# EasyEDA Pro project ProPrj_51单片机核心板_2025-12-06.epro

# Schematic 51单片机核心板原理图
Board Name: 51单片机核心板; Create Date: 2025-12-05; Page Name: P1; Project Name: 51单片机核心板; Schematic Name: 51单片机核心板原理图; Update Date: 2025-12-05; Company: 嘉立创EDA; Page Size: A4; Version: V1.0
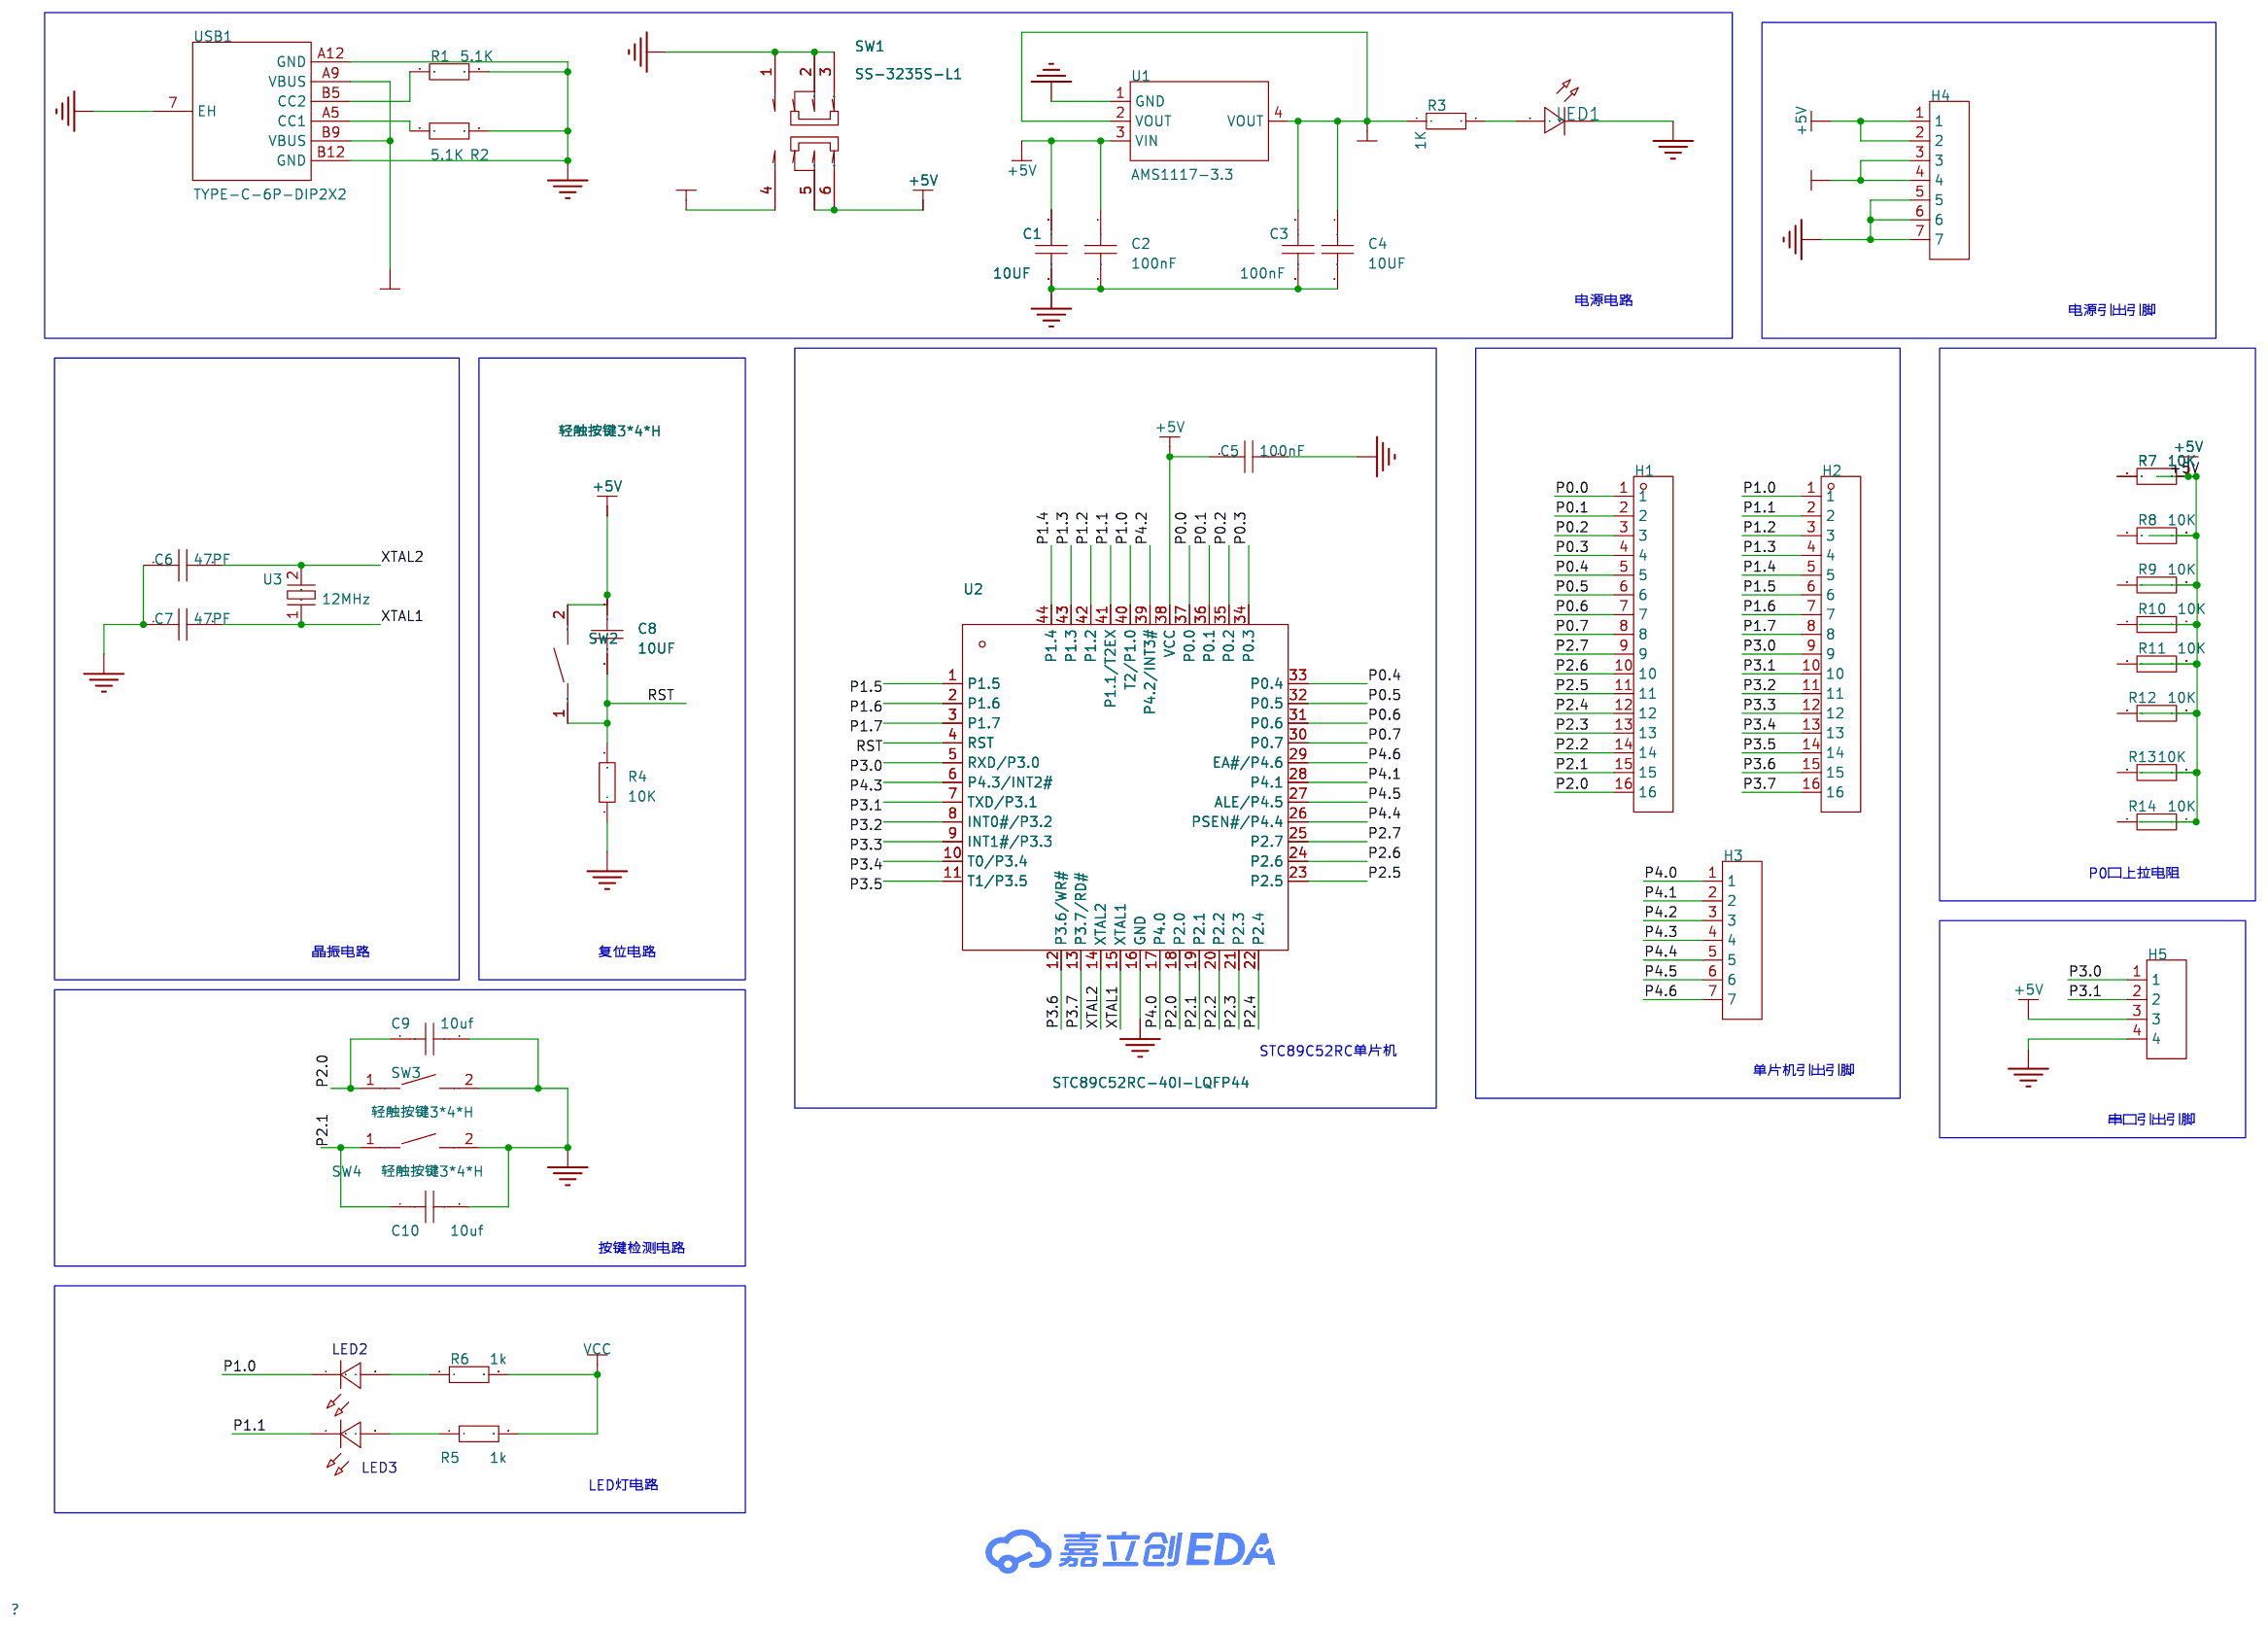
[diagram p0: schematic sheet]

## Parts
C1  10UF  [C0805]
C2  100nF  [C0805]
C3  100nF  [C0805]
C4  10UF  [C0805]
C5  100nF  [C0805]
C6  47PF  [C0603]
C7  47PF  [C0603]
C8  10UF  [C0603]
C9  10uf  [C0603]
C10  10uf  [C0603]
H1  -  [HDR-TH_16P-P2.54-V-M]
H2  -  [HDR-TH_16P-P2.54-V-M]
H3  -  [HDR-TH_7P-P2.54-V-M]
H4  -  [HDR-TH_7P-P2.54-V-M]
H5  -  [HDR-TH_4P-P2.54-V-M]
LED1  -  [LED_0805]
LED2  -  [LED_0805]
LED3  -  [LED_0805]
R1  5.1K  [R0805]
R2  5.1K  [R0805]
R3  1K  [R0805]
R4  10K  [R0603]
R5  1k  [R0603]
R6  1k  [R0603]
R7  10K  [R0603]
R8  10K  [R0603]
R9  10K  [R0603]
R10  10K  [R0603]
R11  10K  [R0603]
R12  10K  [R0603]
R13  10K  [R0603]
R14  10K  [R0603]
SW1  SS-3235S-L1  [SW-SMD_SS-3235S-LX]
SW2  轻触按键3*4*H  [SW-SMD_L4.0-W2.9-LS5.0]
SW3  轻触按键3*4*H  [SW-SMD_L4.0-W2.9-LS5.0]
SW4  轻触按键3*4*H  [SW-SMD_L4.0-W2.9-LS5.0]
U1  AMS1117-3.3  [SOT-223-3_L6.5-W3.4-P2.30-LS7.0-BR]
U2  STC89C52RC-40I-LQFP44  [LQFP-44_L10.0-W10.0-P0.80-LS12.0-BL]
U3  12MHz  [CRYSTAL-SMD_L11.4-W4.7-LS12.7]
USB1  TYPE-C-6P-DIP2X2  [TYPE-C-SMD_TYPE-C-6P]

## Library data of the parts
C1-C5 = CAP_0805: Supplier Footprint: 0805
C6-C10 = CAP_0603: Supplier Footprint: 0603
H1 H2 = HDR-M_2.54_1x16P: 间距:2.54mm;总PIN位数:16;排数:1;插针结构:1x16P;行距:-;安装类型:直插;圆针/方针:方针;额定电流:3A;额定电压:-;配合针长度:6mm;塑高:2.5mm;端接针长度:3mm;触头材质:-;工作温度范围:-40℃~+105℃;颜色:黑色;; Supplier Part: C2894939; Supplier Footprint: 插件
H3 H4 = HDR-M_2.54_1x7P: Supplier Part: C492406; Supplier Footprint: 插件
H5 = HDR-M_2.54_1x4P: Supplier Part: C492403; Supplier Footprint: 插件
LED1 = LED_0805-R: Supplier Footprint: 0805
LED2 LED3 = LED_0805-G: Supplier Footprint: 0805
R1-R3 = Res_0805: Supplier Footprint: 0805
R4-R14 = Res_0603: Supplier Footprint: 0603
SW1 = SS-3235S-L1: 电路结构:双刀双掷;安装方式:卧贴;开关颜色:黑色;额定电流:50mA;额定电压:12V;工作寿命:1万次;; LCSC Part Name: 柄长2mm 卧贴双档 滑动开关; Supplier Part: C500055; Manufacturer: XKB Connection(中国星坤); Supplier Footprint: SMD,9.1x3.6mm; JLCPCB Part Class: 扩展库; Datasheet: https://item.szlcsc.com/datasheet/SS-3235S-L1/512181.html; Supplier: LCSC; Circuit: 双刀双掷; Actuator Style: 矩形柱状; Termination Style: 鸥翼型; Length: 9.1mm; Width: 3.55mm; Switch Height: 3.2mm; Mounting Type: 卧贴; Actuator Color: 黑色; Current Rating: 50mA; Voltage Rating: 12V; Life: 1万次; Operating Temperature: -40℃~+85℃
SW2-SW4 = 轻触按键3*4*H: Supplier Part: C9900017573; Supplier Footprint: 轻触按键3*4*2.5; JLCPCB Part Class: 扩展库; Supplier: LCSC
U1 = AMS1117-3.3_C6186: 输出类型:固定;工作电压:16V;输出电压:3.3V;输出电流:1A;电源纹波抑制比(PSRR):72dB@(120Hz);输出极性:正极;; LCSC Part Name: 输出3.3V 1A; Supplier Part: C6186; Manufacturer: AMS; Supplier Footprint: SOT-223; JLCPCB Part Class: 基础库; Datasheet: https://item.szlcsc.com/datasheet/AMS1117-3.3/6652.html; Supplier: LCSC; Output Type: 固定; Voltage - Supply: 16V; Output Voltage: 3.3V; Output Current: 1A; Power Supply Rejection Ratio (PSRR): 72dB@(120Hz); Voltage Dropout: 1.1V@(800mA); standby current: 5mA; Noise: 0.003%Vout; Features: 过流保护；过热保护; Operating Temperature: -40℃~+125℃; Output Configuration: 正极; Number of Outputs: 1
U2 = STC89C52RC-40I-LQFP44: CPU内核:51系列;应用领域:-;; Supplier Part: C8707; Manufacturer: STC; Supplier Footprint: LQFP-44(10x10); JLCPCB Part Class: 扩展库; Datasheet: https://item.szlcsc.com/datasheet/STC89C52RC-40I-LQFP44/9213.html; Supplier: LCSC; CPU Core: 51系列; Program Storage Size: 8KB; Program Memory Type: FLASH; Number of I/O: 39; Voltage - Supply: 3.3V~5.5V
U3 = ABLS-12.000MHZ-B4H-T: 频率:12MHz;常温频差:±30ppm;负载电容:18pF;频率稳定度:±35ppm;; LCSC Part Name: 12MHz ±30ppm 18pF; Supplier Part: C1986452; Manufacturer: ABRACON; Supplier Footprint: HC-49S-SMD; JLCPCB Part Class: 扩展库; Datasheet: https://item.szlcsc.com/datasheet/ABLS-12.000MHZ-B4H-T/2077997.html; Supplier: LCSC; Normal temperature Frequency Tolerance: ±30ppm; Load Capacitance: 18pF; Frequency Stability: ±35ppm; Equivalent Series Resistance(ESR): 50Ω; Operating Temperature: -20℃~+70℃
USB1 = TYPE-C-6P-DIP2X2: Supplier Part: C9900017627; Supplier Footprint: TYPE-C-6P; JLCPCB Part Class: 扩展库; Supplier: LCSC

## Nets
3.3V: C3.1 C4.1 H4.3 H4.4 R3.1 U1.2(VOUT) U1.4(VOUT)
+5V: C1.1 C2.1 C5.2 C8.2 H4.1 H4.2 H5.3 R7.2 R8.2 R9.2 R10.2 R11.2 R12.2 R13.2 R14.2 SW1.5 SW1.6 SW2.2 U1.3(VIN) U2.38(VCC)
GND: C1.2 C2.2 C3.2 C4.2 C5.1 C6.1 C7.1 C9.2 C10.2 H4.5 H4.6 H4.7 H5.4 LED1.1(C) R1.2 R2.2 R4.1 SW1.1 SW1.2 SW1.3 SW3.2 SW4.2 U1.1(GND) U2.16(GND) USB1.7(EH) USB1.A12(GND) USB1.B12(GND)
VCC: R5.2 R6.2
VCC+5V: SW1.4 USB1.A9(VBUS) USB1.B9(VBUS)
P0.0: H1.1 U2.37(P0.0)
P0.1: H1.2 U2.36(P0.1)
P0.2: H1.3 U2.35(P0.2)
P0.3: H1.4 U2.34(P0.3)
P0.4: H1.5 U2.33(P0.4)
P0.5: H1.6 U2.32(P0.5)
P0.6: H1.7 U2.31(P0.6)
P0.7: H1.8 U2.30(P0.7)
P1.0: H2.1 LED2.1(C) U2.40(T2/P1.0)
P1.1: H2.2 LED3.1(C) U2.41(P1.1/T2EX)
P1.2: H2.3 U2.42(P1.2)
P1.3: H2.4 U2.43(P1.3)
P1.4: H2.5 U2.44(P1.4)
P1.5: H2.6 U2.1(P1.5)
P1.6: H2.7 U2.2(P1.6)
P1.7: H2.8 U2.3(P1.7)
P2.0: C9.1 H1.16 SW3.1 U2.18(P2.0)
P2.1: C10.1 H1.15 SW4.1 U2.19(P2.1)
P2.2: H1.14 U2.20(P2.2)
P2.3: H1.13 U2.21(P2.3)
P2.4: H1.12 U2.22(P2.4)
P2.5: H1.11 U2.23(P2.5)
P2.6: H1.10 U2.24(P2.6)
P2.7: H1.9 U2.25(P2.7)
P3.0: H2.9 H5.1 U2.5(RXD/P3.0)
P3.1: H2.10 H5.2 U2.7(TXD/P3.1)
P3.2: H2.11 U2.8(INT0#/P3.2)
P3.3: H2.12 U2.9(INT1#/P3.3)
P3.4: H2.13 U2.10(T0/P3.4)
P3.5: H2.14 U2.11(T1/P3.5)
P3.6: H2.15 U2.12(P3.6/WR#)
P3.7: H2.16 U2.13(P3.7/RD#)
P4.0: H3.1 U2.17(P4.0)
P4.1: H3.2 U2.28(P4.1)
P4.2: H3.3 U2.39(P4.2/INT3#)
P4.3: H3.4 U2.6(P4.3/INT2#)
P4.4: H3.5 U2.26(PSEN#/P4.4)
P4.5: H3.6 U2.27(ALE/P4.5)
P4.6: H3.7 U2.29(EA#/P4.6)
RST: C8.1 R4.2 SW2.1 U2.4(RST)
XTAL1: C7.2 U2.15(XTAL1) U3.1
XTAL2: C6.2 U2.14(XTAL2) U3.2(GND)
$1N276: R1.1 USB1.B5(CC2)
$1N281: R2.1 USB1.A5(CC1)
$1N990: LED1.2(A) R3.2
$1N3495: LED2.2(A) R6.1
$1N3509: LED3.2(A) R5.1

Not connected (* = marked no-connect by the designer): R7 1; R8 1; R9 1; R10 1; R11 1; R12 1; R13 1; R14 1

## Notes on the sheet
- 电源电路
- 电源引出引脚
- P0口上拉电阻
- 晶振电路
- 复位电路
- STC89C52RC单片机
- 单片机引出引脚
- 串口引出引脚
- 按键检测电路
- LED灯电路

# Board 51单片机核心板pcb
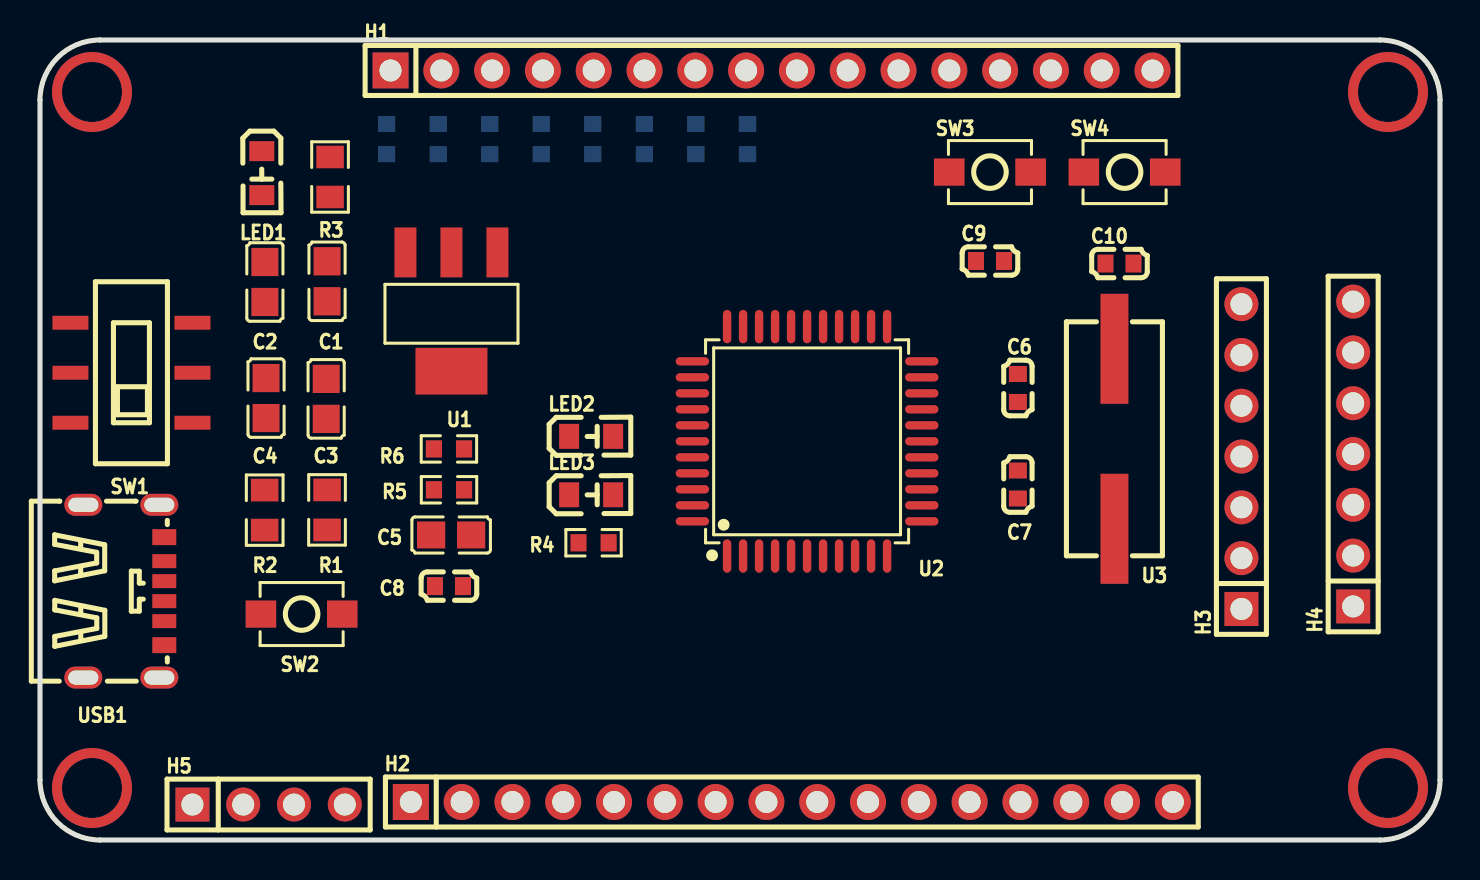
[diagram p1: board, top side]
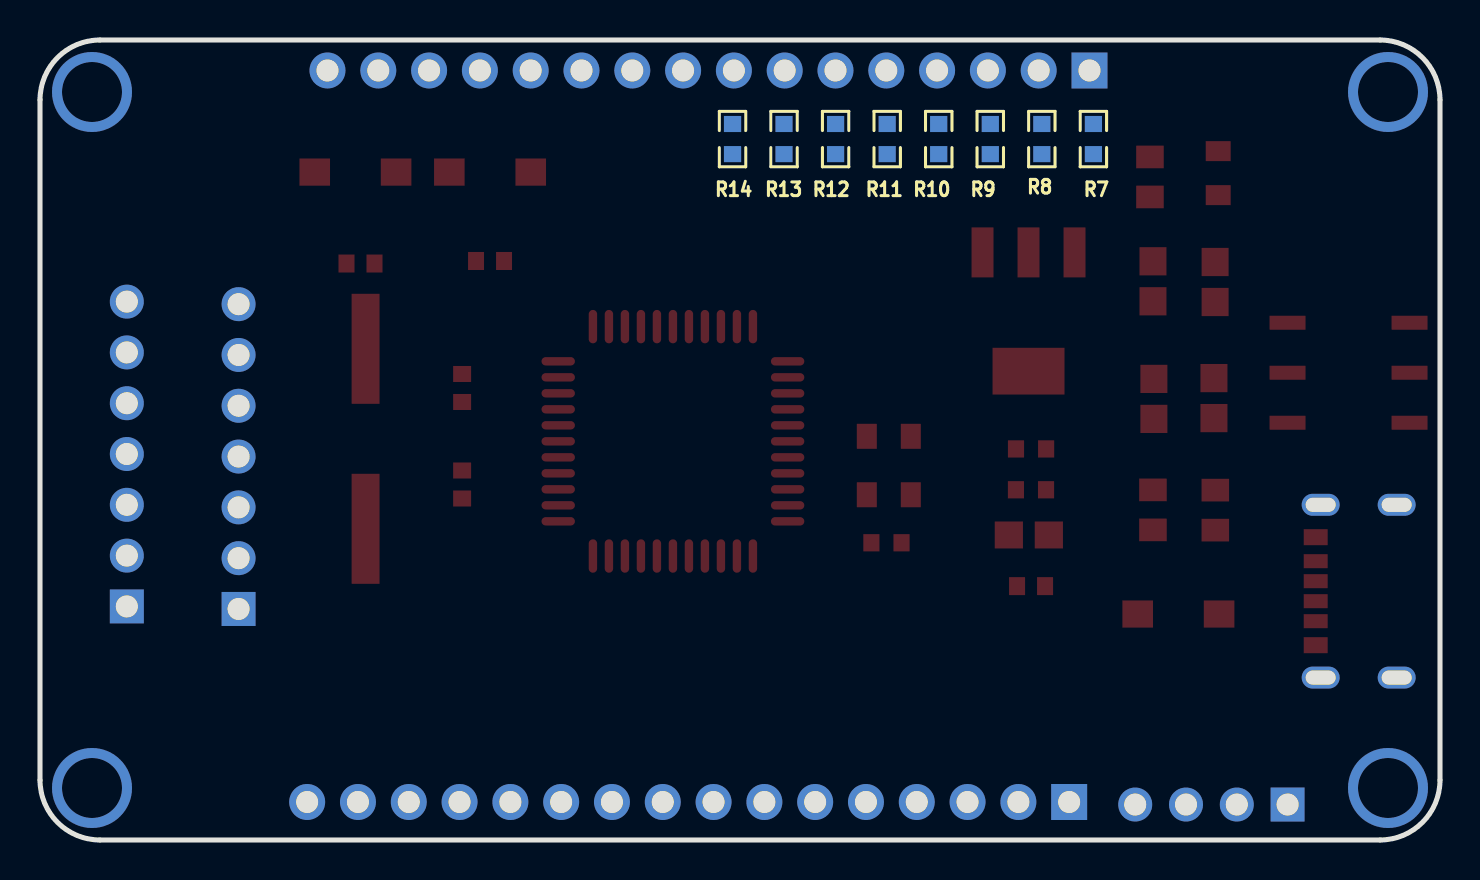
[diagram p2: board, bottom side, seen from below]

Outline 70 x 40 mm; copper layers: Top Layer, Bottom Layer. Coordinates in mm from the lower left corner of the outline.
Outline path: 0,37 0,3 arc(0.88,0.88) 3,0 67,0 arc(69.12,0.88) 70,3 70,37 arc(69.12,39.12) 67,40 3,40 arc(0.88,39.12) 0,37
Stack: Top Layer 0.035mm / Dielectric1 1.51mm FR4 er 4.5 / Bottom Layer 0.035mm

## Design rules (mm)
template: JLCPCB Capability(Two Layers Board)
spacing copperThickness1oz (default): track to track 0.102, other pairs 0.152 to 0.3
spacing copperThickness2oz: track to track 0.203, other pairs 0.152 to 0.3
track width copperThickness1oz (default): min 0.127, default 0.254, max 2.54
track width copperThickness2oz: min 0.203, default 0.254, max 2.54
differential pair differentialPair (default): width min 0.127, default 0.254, max 2.54; gap min 0.152, default 0.152
via viaSize (default): diameter min 0.5, default 0.61, max 10; hole min 0.3, default 0.305, max 6.3

## Placement (name value [footprint] x y rotation side)
C1  10UF  [C0805]  14.35 27.94 270 top
C2  100nF  [C0805]  11.24 27.9 270 top
C3  100nF  [C0805]  14.31 22.06 90 top
C4  10UF  [C0805]  11.3 22.1 90 top
C5  100nF  [C0805]  20.56 15.25 0 top
C6  47PF  [C0603]  48.9 22.6 90 top
C7  47PF  [C0603]  48.9 17.78 90 top
C8  10UF  [C0603]  20.45 12.69 180 top
C9  10uf  [C0603]  47.5 28.95 0 top
C10  10uf  [C0603]  53.97 28.82 0 top
H1  -  [HDR-TH_16P-P2.54-V-M]  36.58 38.48 0 top
H2  -  [HDR-TH_16P-P2.54-V-M]  37.59 1.9 0 top
H3  -  [HDR-TH_7P-P2.54-V-M]  60.07 19.17 90 top
H4  -  [HDR-TH_7P-P2.54-V-M]  65.66 19.3 90 top
H5  -  [HDR-TH_4P-P2.54-V-M]  11.43 1.77 0 top
LED1  -  [LED_0805]  11.09 33.29 270 top
LED2  -  [LED_0805]  27.61 20.18 0 top
LED3  -  [LED_0805]  27.61 17.26 0 top
R1  5.1K  [R0805]  14.35 16.5 90 top
R2  5.1K  [R0805]  11.23 16.49 270 top
R3  1K  [R0805]  14.5 33.15 90 top
R4  10K  [R0603]  27.68 14.86 0 top
R5  1k  [R0603]  20.45 17.51 0 top
R6  1k  [R0603]  20.45 19.55 0 top
R7  10K  [R0603]  17.33 35.05 90 bottom
R8  10K  [R0603]  19.91 35.05 90 bottom
R9  10K  [R0603]  22.49 35.05 90 bottom
R10  10K  [R0603]  25.06 35.05 90 bottom
R11  10K  [R0603]  27.64 35.05 90 bottom
R12  10K  [R0603]  30.22 35.05 90 bottom
R13  10K  [R0603]  32.8 35.05 90 bottom
R14  10K  [R0603]  35.37 35.05 90 bottom
SW1  SS-3235S-L1  [SW-SMD_SS-3235S-LX]  4.57 23.36 270 top
SW2  轻触按键3*4*H  [SW-SMD_L4.0-W2.9-LS5.0]  13.08 11.3 0 top
SW3  轻触按键3*4*H  [SW-SMD_L4.0-W2.9-LS5.0]  47.5 33.4 0 top
SW4  轻触按键3*4*H  [SW-SMD_L4.0-W2.9-LS5.0]  54.23 33.4 0 top
U1  AMS1117-3.3  [SOT-223-3_L6.5-W3.4-P2.30-LS7.0-BR]  20.57 26.41 90 top
U2  STC89C52RC-40I-LQFP44  [LQFP-44_L10.0-W10.0-P0.80-LS12.0-BL]  38.35 19.93 0 top
U3  12MHz  [CRYSTAL-SMD_L11.4-W4.7-LS12.7]  53.72 20.06 90 top
USB1  TYPE-C-6P-DIP2X2  [TYPE-C-SMD_TYPE-C-6P]  4.19 12.44 270 top

## Footprints (pads in the part's own frame, mm; a bottom-side part is the same pattern mirrored in y, then rotated)
C0603
  rect 0.8x0.9 smd: 1(-0.7,0) 2(0.7,0)
C0805
  rect 1.41x1.35 smd: 1(-1,0) 2(1,0)
CRYSTAL-SMD_L11.4-W4.7-LS12.7
  rect 5.5x1.4 smd: 1(-4.5,0) 2(4.5,0)
HDR-TH_4P-P2.54-V-M
  rect 1.7x1.7 hole 1.1: 1(-3.81,0)
  round 1.7 hole 1.1: 2(-1.27,0) 3(1.27,0) 4(3.81,0)
HDR-TH_7P-P2.54-V-M
  rect 1.7x1.7 hole 1.1: 1(-7.62,0)
  round 1.7 hole 1.1: 2(-5.08,0) 3(-2.54,0) 4(0,0) 5(2.54,0) 6(5.08,0) 7(7.62,0)
HDR-TH_16P-P2.54-V-M
  rect 1.8x1.8 hole 1.1: 1(-19.05,0)
  round 1.8 hole 1.1: 2(-16.51,0) 3(-13.97,0) 4(-11.43,0) 5(-8.89,0) 6(-6.35,0) 7(-3.81,0) 8(-1.27,0) 9(1.27,0) 10(3.81,0) 11(6.35,0) 12(8.89,0) 13(11.43,0) 14(13.97,0) 15(16.51,0) 16(19.05,0)
LED_0805
  rect 1x1.25 smd: 1(-1.15,0.005) 2(1.05,0.005)
LQFP-44_L10.0-W10.0-P0.80-LS12.0-BL
  oval 0.42x1.67 smd: 1(-4,-5.735) 2(-3.2,-5.735) 3(-2.4,-5.735) 4(-1.6,-5.735) 5(-0.8,-5.735) 6(0,-5.735) 7(0.8,-5.735) 8(1.6,-5.735) 9(2.4,-5.735) 10(3.2,-5.735) 11(4,-5.735) 23(4,5.735) 24(3.2,5.735) 25(2.4,5.735) 26(1.6,5.735) 27(0.8,5.735) 28(0,5.735) 29(-0.8,5.735) 30(-1.6,5.735) 31(-2.4,5.735) 32(-3.2,5.735) 33(-4,5.735)
  oval 1.67x0.42 smd: 12(5.735,-4) 13(5.735,-3.2) 14(5.735,-2.4) 15(5.735,-1.6) 16(5.735,-0.8) 17(5.735,0) 18(5.735,0.8) 19(5.735,1.6) 20(5.735,2.4) 21(5.735,3.2) 22(5.735,4) 34(-5.735,4) 35(-5.735,3.2) 36(-5.735,2.4) 37(-5.735,1.6) 38(-5.735,0.8) 39(-5.735,0) 40(-5.735,-0.8) 41(-5.735,-1.6) 42(-5.735,-2.4) 43(-5.735,-3.2) 44(-5.735,-4)
R0603
  rect 0.806x0.864 smd: 1(-0.753,0) 2(0.753,0)
R0805
  rect 1.133x1.377 smd: 1(-1,0) 2(1,0)
SOT-223-3_L6.5-W3.4-P2.30-LS7.0-BR
  rect 2.5x1.1 smd: 1(2.97,-2.3) 2(2.97,0) 3(2.97,2.3)
  rect 2.34x3.6 smd: 4(-2.97,0)
SW-SMD_L4.0-W2.9-LS5.0
  rect 1.53x1.36 smd: 1(-2.035,0) 2(2.035,0)
SW-SMD_SS-3235S-LX
  rect 0.7x1.8 smd: 1(-2.5,3.05) 2(0,3.05) 3(2.5,3.05) 4(-2.5,-3.05) 5(0,-3.05) 6(2.5,-3.05)
TYPE-C-SMD_TYPE-C-6P
  oval 1.1x1.9 hole 0.7x1.5: 7(-4.32,1.775) 7(-4.32,-2.025) 7(4.32,1.775) 7(4.32,-2.025)
  rect 0.7x1.2 smd: A5(-0.5,2.025) A9(1.5,2.025) B5(0.5,2.025) B9(-1.5,2.025)
  rect 0.8x1.2 smd: A12(2.7,2.025) B12(-2.7,2.025)

## Nets
As in the schematic, except:
P0.0: H1.1 R7.1 U2.37
P0.1: H1.2 R8.1 U2.36
P0.2: H1.3 R9.1 U2.35
P0.3: H1.4 R10.1 U2.34
P0.4: H1.5 R11.1 U2.33
P0.5: H1.6 R12.1 U2.32
P0.6: H1.7 R13.1 U2.31
P0.7: H1.8 R14.1 U2.30

## Via types
v1: diameter 4, hole 3, Top Layer to Bottom Layer, 4 vias

## Routing (per net, layer and track width the routed paths; a pad name or vN(x,y) marks a point on that pad's centre or on a via; arc(x,y) is an arc through that point)
(no net):
  vias: v1(2.6,37.4) v1(2.6,2.6) v1(67.4,37.4) v1(67.4,2.6)
